# EAGLE schematic Dx32_V1.0 (EAGLE 9.6.2)

## Sheet 1 of 2
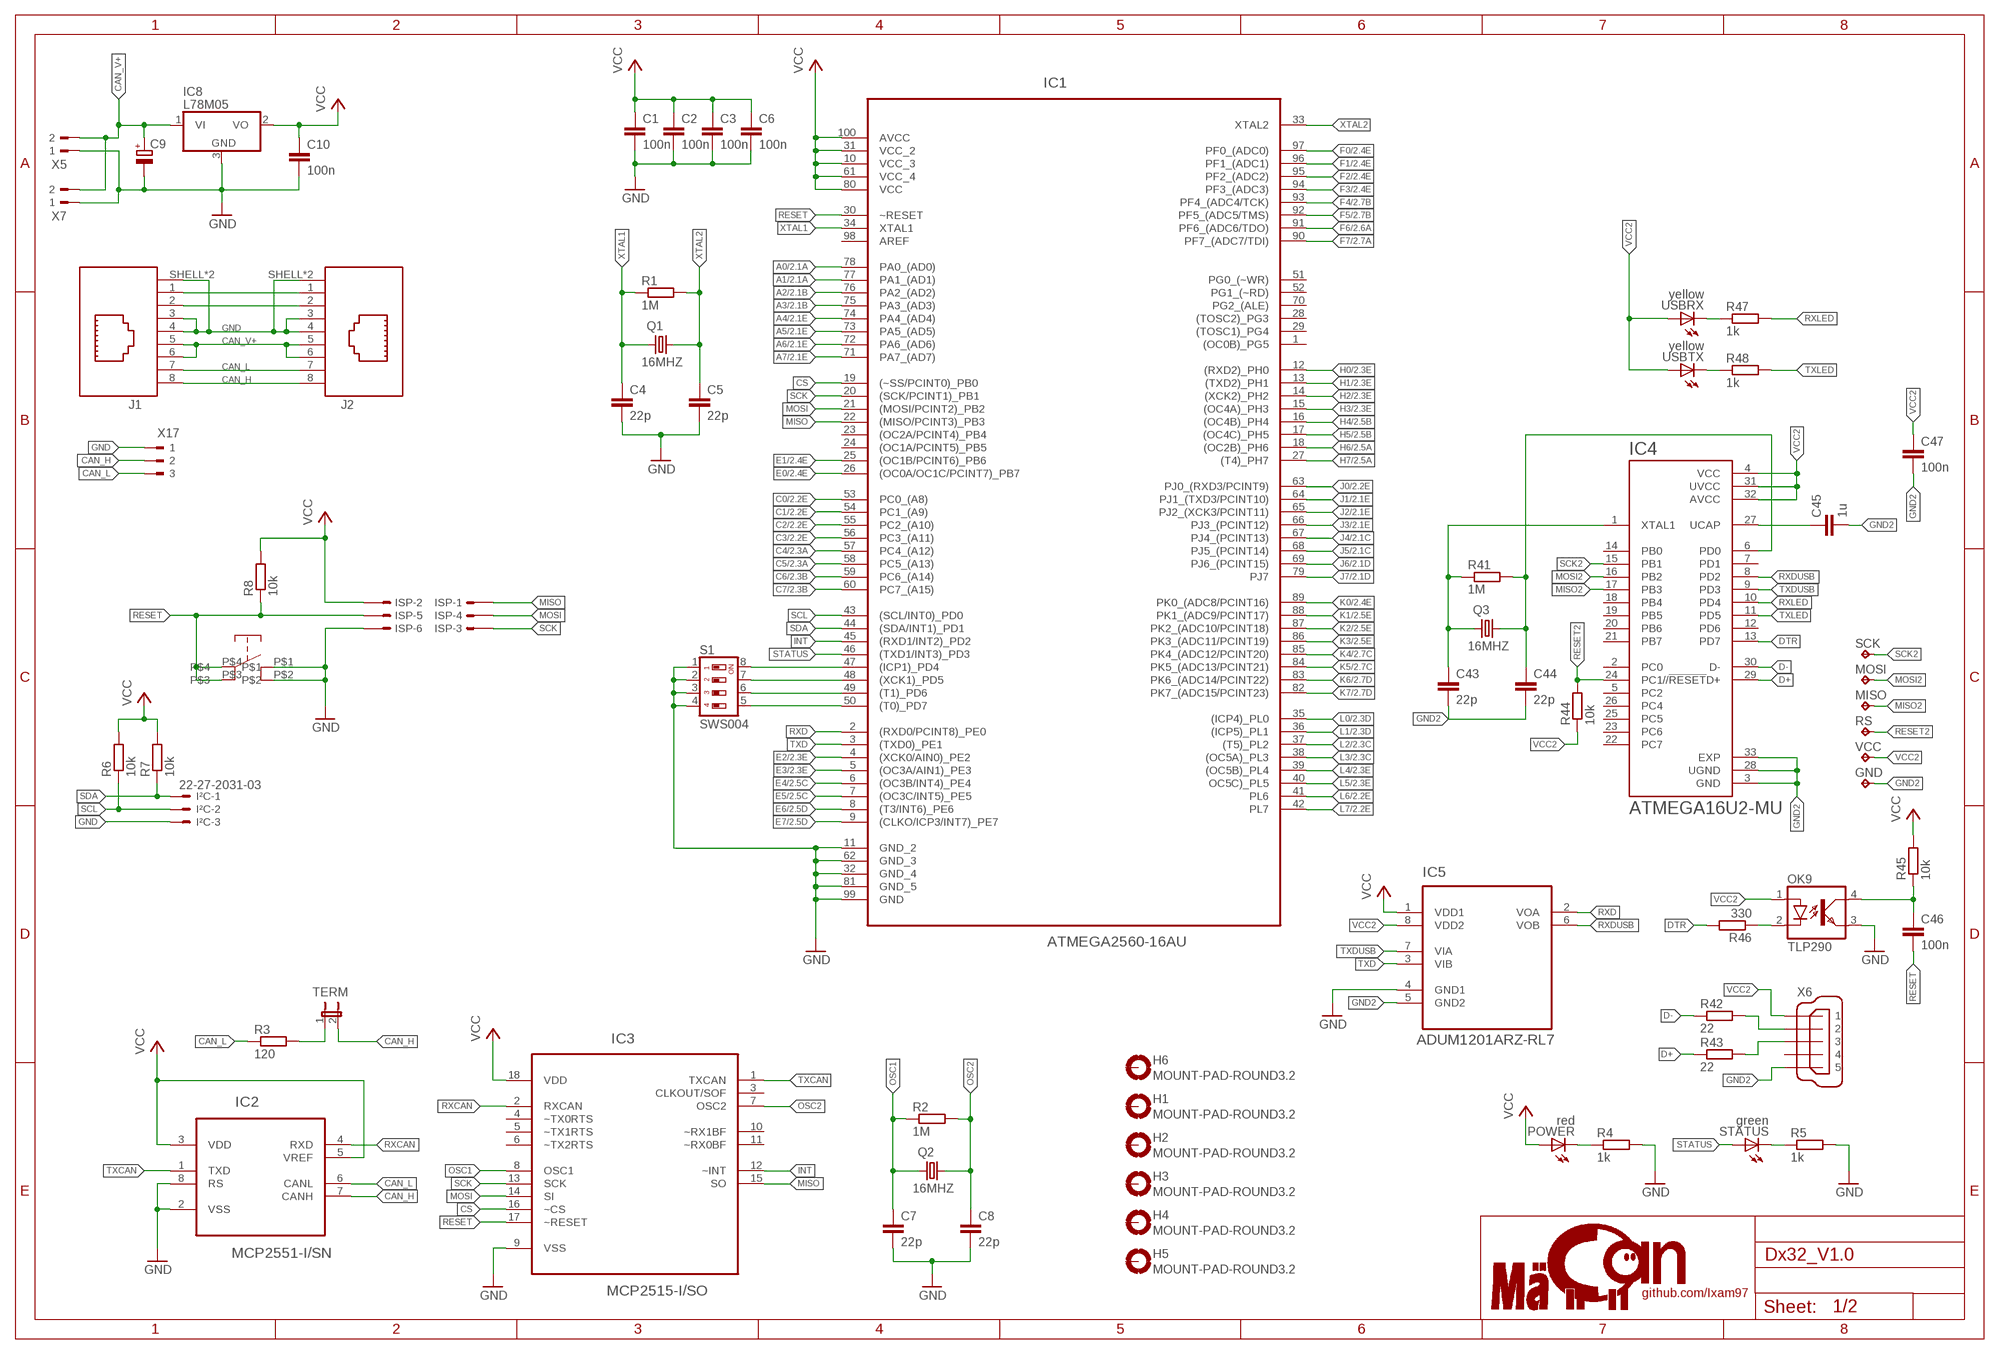
[diagram p0: schematic, sheet 1]

### Parts
C1  100n  C-EUC0402  [C0402]
C2  100n  C-EUC0402  [C0402]
C3  100n  C-EUC0402  [C0402]
C4  22p  C-EUC0402  [C0402]
C5  22p  C-EUC0402  [C0402]
C6  100n  C-EUC0402  [C0402]
C7  22p  C-EUC0402  [C0402]
C8  22p  C-EUC0402  [C0402]
C9  CPOL-EUCT3216  [CT3216]
C10  100n  C-EUC0402  [C0402]
C43  22p  C-EUC0402  [C0402]
C44  22p  C-EUC0402  [C0402]
C45  1u  C-EUC0402  [C0402]
C46  100n  C-EUC0402  [C0402]
C47  100n  C-EUC0402  [C0402]
GND  TPB1,27  [B1,27]
H1  MOUNT-PAD-ROUND3.2  [3,2-PAD]
H2  MOUNT-PAD-ROUND3.2  [3,2-PAD]
H3  MOUNT-PAD-ROUND3.2  [3,2-PAD]
H4  MOUNT-PAD-ROUND3.2  [3,2-PAD]
H5  MOUNT-PAD-ROUND3.2  [3,2-PAD]
H6  MOUNT-PAD-ROUND3.2  [3,2-PAD]
IC1  ATMEGA2560-16AU  [QFP50P1600X1600X120-100N]
IC2  MCP2551-I/SN  [SOIC127P600X175-8N]
IC3  MCP2515-I/SO  [SOIC127P1034X264-18N]
IC4  ATMEGA16U2-MU  [QFN50P500X500X100-33N]
IC5  ADUM1201ARZ-RL7  [SOIC127P600X175-8N]
IC8  L78M05  7805DT  [TO252]
ISP  057-006-1  [057-006-1]
I²C  22-27-2031-03  [6410-03]
J1  615008140421  [615008140421]
J2  615008140421  [615008140421]
MISO  TPB1,27  [B1,27]
MOSI  TPB1,27  [B1,27]
OK9  TLP290  TLP283  [MINI-FLAT-4]
POWER  red  LEDCHIP-LED0805  [CHIP-LED0805]
Q1  16MHZ  KX-7  [3.2X2.5_KX-7]
Q2  16MHZ  KX-7  [3.2X2.5_KX-7]
Q3  16MHZ  KX-7  [3.2X2.5_KX-7]
R1  1M  R-EU_R0402  [R0402]
R2  1M  R-EU_R0402  [R0402]
R3  120  R-EU_R0402  [R0402]
R4  1k  R-EU_R0402  [R0402]
R5  1k  R-EU_R0402  [R0402]
R6  10k  R-EU_R0402  [R0402]
R7  10k  R-EU_R0402  [R0402]
R8  10k  R-EU_R0402  [R0402]
R41  1M  R-EU_R0402  [R0402]
R42  22  R-EU_R0402  [R0402]
R43  22  R-EU_R0402  [R0402]
R44  10k  R-EU_R0402  [R0402]
R45  10k  R-EU_R0402  [R0402]
R46  330  R-EU_R0402  [R0402]
R47  1k  R-EU_R0402  [R0402]
R48  1k  R-EU_R0402  [R0402]
RS  TPB1,27  [B1,27]
S1  SWS004  [SMS-004]
SCK  TPB1,27  [B1,27]
STATUS  green  LEDCHIP-LED0805  [CHIP-LED0805]
TERM  JP1E  [JP1]
U$15  BUTTON_JLC  [BUTTON]
USBRX  yellow  LEDCHIP-LED0805  [CHIP-LED0805]
USBTX  yellow  LEDCHIP-LED0805  [CHIP-LED0805]
VCC  TPB1,27  [B1,27]
X5  180-2  [180-2]
X6  MINI-USB_SHIELD5P2-32005-601  [32005-601]
X7  180-2  [180-2]
X17  180-3  [180-3]

### Nets
A0: IC1.78(PA0_(AD0)) ; also sheet 2
A1: IC1.77(PA1_(AD1)) ; also sheet 2
A2: IC1.76(PA2_(AD2)) ; also sheet 2
A3: IC1.75(PA3_(AD3)) ; also sheet 2
A4: IC1.74(PA4_(AD4)) ; also sheet 2
A5: IC1.73(PA5_(AD5)) ; also sheet 2
A6: IC1.72(PA6_(AD6)) ; also sheet 2
A7: IC1.71(PA7_(AD7)) ; also sheet 2
C0: IC1.53(PC0_(A8)) ; also sheet 2
C1: IC1.54(PC1_(A9)) ; also sheet 2
C2: IC1.55(PC2_(A10)) ; also sheet 2
C3: IC1.56(PC3_(A11)) ; also sheet 2
C4: IC1.57(PC4_(A12)) ; also sheet 2
C5: IC1.58(PC5_(A13)) ; also sheet 2
C6: IC1.59(PC6_(A14)) ; also sheet 2
C7: IC1.60(PC7_(A15)) ; also sheet 2
CAN_H: IC2.7(CANH) J1.8 J2.8 TERM.2 X17.2
CAN_L: IC2.6(CANL) J1.7 J2.7 R3.1 X17.3
CAN_V+: C9.+ IC8.1(VI) J1.5 J1.6 J2.5 J2.6 X5.2 X7.2
CS: IC1.19((~SS/PCINT0)_PB0) IC3.16(~CS)
D+: IC4.29(D+) R43.1
D-: IC4.30(D-) R42.1
DTR: IC4.13(PD7) R46.2
E0: IC1.26((OC0A/OC1C/PCINT7)_PB7) ; also sheet 2
E1: IC1.25((OC1B/PCINT6)_PB6) ; also sheet 2
E2: IC1.4((XCK0/AIN0)_PE2) ; also sheet 2
E3: IC1.5((OC3A/AIN1)_PE3) ; also sheet 2
E4: IC1.6((OC3B/INT4)_PE4) ; also sheet 2
E5: IC1.7((OC3C/INT5)_PE5) ; also sheet 2
E6: IC1.8((T3/INT6)_PE6) ; also sheet 2
E7: IC1.9((CLKO/ICP3/INT7)_PE7) ; also sheet 2
F0: IC1.97(PF0_(ADC0)) ; also sheet 2
F1: IC1.96(PF1_(ADC1)) ; also sheet 2
F2: IC1.95(PF2_(ADC2)) ; also sheet 2
F3: IC1.94(PF3_(ADC3)) ; also sheet 2
F4: IC1.93(PF4_(ADC4/TCK)) ; also sheet 2
F5: IC1.92(PF5_(ADC5/TMS)) ; also sheet 2
F6: IC1.91(PF6_(ADC6/TDO)) ; also sheet 2
F7: IC1.90(PF7_(ADC7/TDI)) ; also sheet 2
GND: C1.2 C2.2 C3.2 C4.2 C5.2 C6.2 C7.2 C8.2 C9.- C10.2 IC1.11(GND_2) IC1.32(GND_4) IC1.62(GND_3) IC1.81(GND_5) IC1.99(GND) IC2.2(VSS) IC2.8(RS) IC3.9(VSS) IC5.4(GND1) IC8.3(GND) ISP.6 I²C.3 J1.3 J1.4 J1.SHELL1(SHIELD) J1.SHELL(SHIELD) J2.3 J2.4 J2.SHELL1(SHIELD) J2.SHELL(SHIELD) OK9.3(EMIT) R4.2 R5.2 S1.1 S1.2 S1.3 S1.4 U$15.P$1 U$15.P$2 X5.1 X7.1 X17.1 ; also sheet 2
GND2: C43.2 C44.2 C45.2 C47.2 GND.TP IC4.3(GND) IC4.28(UGND) IC4.33(EXP) IC5.5(GND2) X6.5
H0: IC1.12((RXD2)_PH0) ; also sheet 2
H1: IC1.13((TXD2)_PH1) ; also sheet 2
H2: IC1.14((XCK2)_PH2) ; also sheet 2
H3: IC1.15((OC4A)_PH3) ; also sheet 2
H4: IC1.16((OC4B)_PH4) ; also sheet 2
H5: IC1.17((OC4C)_PH5) ; also sheet 2
H6: IC1.18((OC2B)_PH6) ; also sheet 2
H7: IC1.27((T4)_PH7) ; also sheet 2
INT: IC1.45((RXD1/INT2)_PD2) IC3.12(~INT)
J0: IC1.63(PJ0_(RXD3/PCINT9)) ; also sheet 2
J1: IC1.64(PJ1_(TXD3/PCINT10)) ; also sheet 2
J2: IC1.65(PJ2_(XCK3/PCINT11)) ; also sheet 2
J3: IC1.66(PJ3_(PCINT12)) ; also sheet 2
J4: IC1.67(PJ4_(PCINT13)) ; also sheet 2
J5: IC1.68(PJ5_(PCINT14)) ; also sheet 2
J6: IC1.69(PJ6_(PCINT15)) ; also sheet 2
J7: IC1.79(PJ7) ; also sheet 2
K0: IC1.89(PK0_(ADC8/PCINT16)) ; also sheet 2
K1: IC1.88(PK1_(ADC9/PCINT17)) ; also sheet 2
K2: IC1.87(PK2_(ADC10/PCINT18)) ; also sheet 2
K3: IC1.86(PK3_(ADC11/PCINT19)) ; also sheet 2
K4: IC1.85(PK4_(ADC12/PCINT20)) ; also sheet 2
K5: IC1.84(PK5_(ADC13/PCINT21)) ; also sheet 2
K6: IC1.83(PK6_(ADC14/PCINT22)) ; also sheet 2
K7: IC1.82(PK7_(ADC15/PCINT23)) ; also sheet 2
L0: IC1.35((ICP4)_PL0) ; also sheet 2
L1: IC1.36((ICP5)_PL1) ; also sheet 2
L2: IC1.37((T5)_PL2) ; also sheet 2
L3: IC1.38((OC5A)_PL3) ; also sheet 2
L4: IC1.39((OC5B)_PL4) ; also sheet 2
L5: IC1.40(OC5C)_PL5) ; also sheet 2
L6: IC1.41(PL6) ; also sheet 2
L7: IC1.42(PL7) ; also sheet 2
MISO: IC1.22((MISO/PCINT3)_PB3) IC3.15(SO) ISP.1
MISO2: IC4.17(PB3) MISO.TP
MOSI: IC1.21((MOSI/PCINT2)_PB2) IC3.14(SI) ISP.4
MOSI2: IC4.16(PB2) MOSI.TP
N$10: C46.1 OK9.4(COL) R45.1
N$17: IC1.47((ICP1)_PD4) S1.8
N$18: IC1.48((XCK1)_PD5) S1.7
N$19: IC1.49((T1)_PD6) S1.6
N$20: IC1.50((T0)_PD7) S1.5
N$21: J1.1 J2.1
N$27: OK9.2(C) R46.1
N$39: J1.2 J2.2
N$49: R48.1 USBTX.C
N$62: R47.1 USBRX.C
N$128: C45.1 IC4.27(UCAP)
N$129: R42.2 X6.2
N$130: R43.2 X6.3
N$133: POWER.C R4.1
N$134: R3.2 TERM.1
N$137: R5.1 STATUS.C
OSC1: C7.1 IC3.8(OSC1) Q2.1 R2.1
OSC2: C8.1 IC3.7(OSC2) Q2.3 R2.2
OSC3: C43.1 IC4.1(XTAL1) Q3.1 R41.1
OSC4: C44.1 IC4.6(PD0) Q3.3 R41.2
RESET: C46.2 IC1.30(~RESET) IC3.17(~RESET) ISP.5 R8.1 U$15.P$3 U$15.P$4
RESET2: IC4.24(PC1//!RESET) R44.2 RS.TP
RXCAN: IC2.4(RXD) IC3.2(RXCAN)
RXD: IC1.2((RXD0/PCINT8)_PE0) IC5.2(VOA)
RXDUSB: IC4.8(PD2) IC5.6(VOB)
RXLED: IC4.10(PD4) R47.2
SCK: IC1.20((SCK/PCINT1)_PB1) IC3.13(SCK) ISP.3
SCK2: IC4.15(PB1) SCK.TP
SCL: IC1.43((SCL/INT0)_PD0) I²C.2 R6.1
SDA: IC1.44((SDA/INT1)_PD1) I²C.1 R7.1
STATUS: IC1.46((TXD1/INT3)_PD3) STATUS.A
TXCAN: IC2.1(TXD) IC3.1(TXCAN)
TXD: IC1.3((TXD0)_PE1) IC5.3(VIB)
TXDUSB: IC4.9(PD3) IC5.7(VIA)
TXLED: IC4.11(PD5) R48.2
VCC: C1.1 C2.1 C3.1 C6.1 C10.1 IC1.10(VCC_3) IC1.31(VCC_2) IC1.61(VCC_4) IC1.80(VCC) IC1.100(AVCC) IC2.3(VDD) IC2.5(VREF) IC3.18(VDD) IC5.1(VDD1) IC8.2(VO) ISP.2 POWER.A R6.2 R7.2 R8.2 R45.2 ; also sheet 2
VCC2: C47.1 IC4.4(VCC) IC4.31(UVCC) IC4.32(AVCC) IC5.8(VDD2) OK9.1(A) R44.1 USBRX.A USBTX.A VCC.TP X6.1
XTAL1: C4.1 IC1.34(XTAL1) Q1.1 R1.1
XTAL2: C5.1 IC1.33(XTAL2) Q1.3 R1.2
Unconnected: H1.B3,2(MOUNT) H2.B3,2(MOUNT) H3.B3,2(MOUNT) H4.B3,2(MOUNT) H5.B3,2(MOUNT) H6.B3,2(MOUNT) IC1.1((OC0B)_PG5) IC1.23((OC2A/PCINT4)_PB4) IC1.24((OC1A/PCINT5)_PB5) IC1.28((TOSC2)_PG3) IC1.29((TOSC1)_PG4) IC1.51(PG0_(~WR)) IC1.52(PG1_(~RD)) IC1.70(PG2_(ALE)) IC1.98(AREF) IC3.3(CLKOUT/SOF) IC3.4(~TX0RTS) IC3.5(~TX1RTS) IC3.6(~TX2RTS) IC3.10(~RX1BF) IC3.11(~RX0BF) IC4.2(PC0) IC4.5(PC2) IC4.7(PD1) IC4.12(PD6) IC4.14(PB0) IC4.18(PB4) IC4.19(PB5) IC4.20(PB6) IC4.21(PB7) IC4.22(PC7) IC4.23(PC6) IC4.25(PC5) IC4.26(PC4) X6.4 X6.M1(S1) X6.M2(S2)

## Sheet 2 of 2
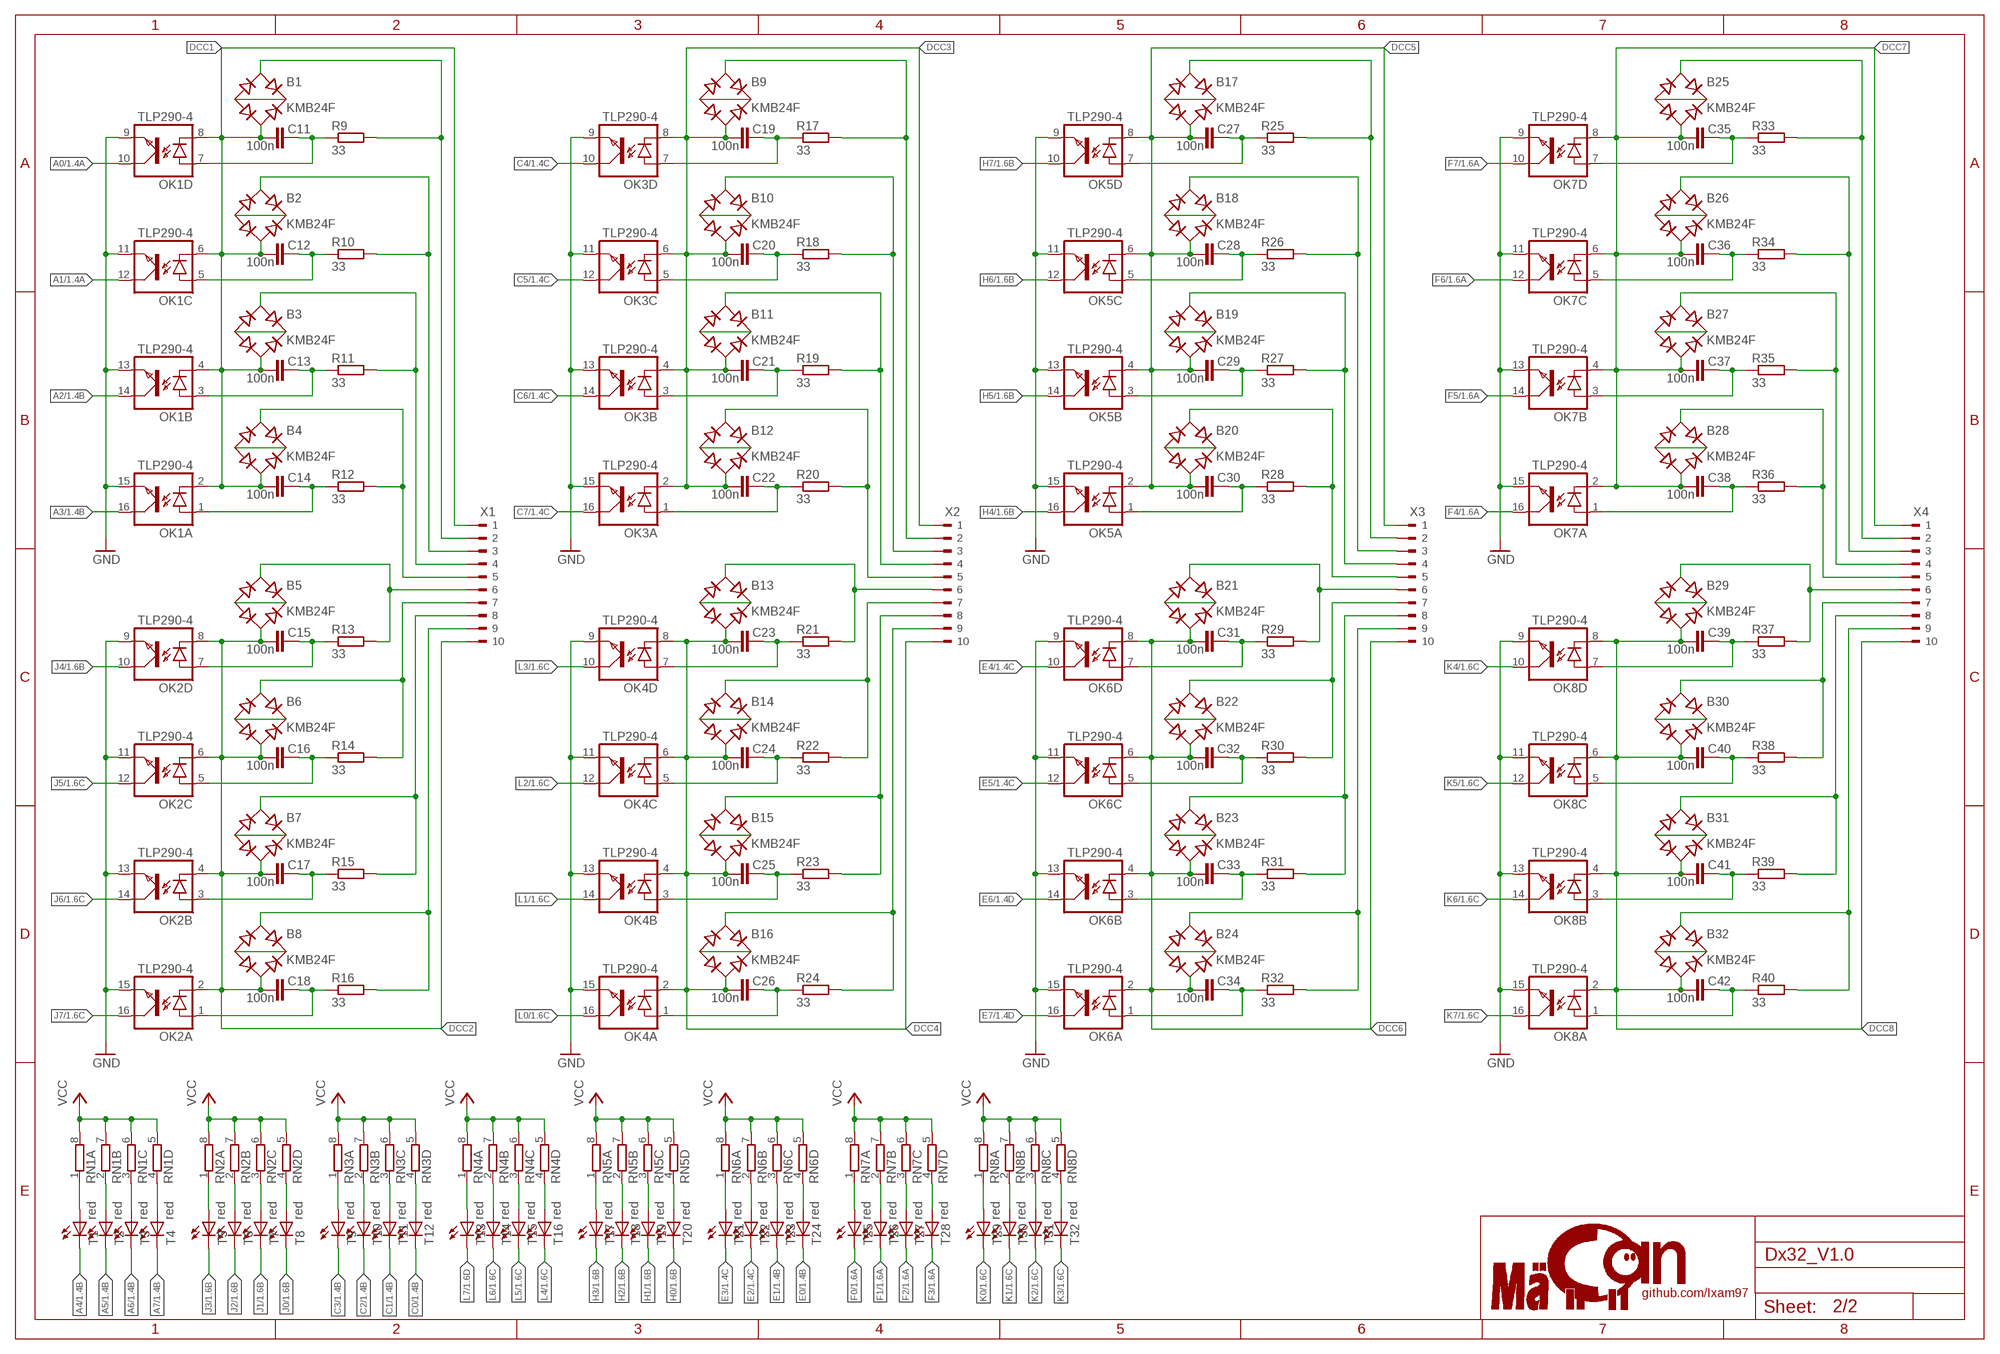
[diagram p1: schematic, sheet 2]

### Parts
B1  KMB24F  B2S  [MBS]
B2  KMB24F  B2S  [MBS]
B3  KMB24F  B2S  [MBS]
B4  KMB24F  B2S  [MBS]
B5  KMB24F  B2S  [MBS]
B6  KMB24F  B2S  [MBS]
B7  KMB24F  B2S  [MBS]
B8  KMB24F  B2S  [MBS]
B9  KMB24F  B2S  [MBS]
B10  KMB24F  B2S  [MBS]
B11  KMB24F  B2S  [MBS]
B12  KMB24F  B2S  [MBS]
B13  KMB24F  B2S  [MBS]
B14  KMB24F  B2S  [MBS]
B15  KMB24F  B2S  [MBS]
B16  KMB24F  B2S  [MBS]
B17  KMB24F  B2S  [MBS]
B18  KMB24F  B2S  [MBS]
B19  KMB24F  B2S  [MBS]
B20  KMB24F  B2S  [MBS]
B21  KMB24F  B2S  [MBS]
B22  KMB24F  B2S  [MBS]
B23  KMB24F  B2S  [MBS]
B24  KMB24F  B2S  [MBS]
B25  KMB24F  B2S  [MBS]
B26  KMB24F  B2S  [MBS]
B27  KMB24F  B2S  [MBS]
B28  KMB24F  B2S  [MBS]
B29  KMB24F  B2S  [MBS]
B30  KMB24F  B2S  [MBS]
B31  KMB24F  B2S  [MBS]
B32  KMB24F  B2S  [MBS]
C11  100n  C-EUC0402  [C0402]
C12  100n  C-EUC0402  [C0402]
C13  100n  C-EUC0402  [C0402]
C14  100n  C-EUC0402  [C0402]
C15  100n  C-EUC0402  [C0402]
C16  100n  C-EUC0402  [C0402]
C17  100n  C-EUC0402  [C0402]
C18  100n  C-EUC0402  [C0402]
C19  100n  C-EUC0402  [C0402]
C20  100n  C-EUC0402  [C0402]
C21  100n  C-EUC0402  [C0402]
C22  100n  C-EUC0402  [C0402]
C23  100n  C-EUC0402  [C0402]
C24  100n  C-EUC0402  [C0402]
C25  100n  C-EUC0402  [C0402]
C26  100n  C-EUC0402  [C0402]
C27  100n  C-EUC0402  [C0402]
C28  100n  C-EUC0402  [C0402]
C29  100n  C-EUC0402  [C0402]
C30  100n  C-EUC0402  [C0402]
C31  100n  C-EUC0402  [C0402]
C32  100n  C-EUC0402  [C0402]
C33  100n  C-EUC0402  [C0402]
C34  100n  C-EUC0402  [C0402]
C35  100n  C-EUC0402  [C0402]
C36  100n  C-EUC0402  [C0402]
C37  100n  C-EUC0402  [C0402]
C38  100n  C-EUC0402  [C0402]
C39  100n  C-EUC0402  [C0402]
C40  100n  C-EUC0402  [C0402]
C41  100n  C-EUC0402  [C0402]
C42  100n  C-EUC0402  [C0402]
OK1  TLP290-4  TLP283-4  [MINI-FLAT-16]
OK2  TLP290-4  TLP283-4  [MINI-FLAT-16]
OK3  TLP290-4  TLP283-4  [MINI-FLAT-16]
OK4  TLP290-4  TLP283-4  [MINI-FLAT-16]
OK5  TLP290-4  TLP283-4  [MINI-FLAT-16]
OK6  TLP290-4  TLP283-4  [MINI-FLAT-16]
OK7  TLP290-4  TLP283-4  [MINI-FLAT-16]
OK8  TLP290-4  TLP283-4  [MINI-FLAT-16]
R9  33  R-EU_R0402  [R0402]
R10  33  R-EU_R0402  [R0402]
R11  33  R-EU_R0402  [R0402]
R12  33  R-EU_R0402  [R0402]
R13  33  R-EU_R0402  [R0402]
R14  33  R-EU_R0402  [R0402]
R15  33  R-EU_R0402  [R0402]
R16  33  R-EU_R0402  [R0402]
R17  33  R-EU_R0402  [R0402]
R18  33  R-EU_R0402  [R0402]
R19  33  R-EU_R0402  [R0402]
R20  33  R-EU_R0402  [R0402]
R21  33  R-EU_R0402  [R0402]
R22  33  R-EU_R0402  [R0402]
R23  33  R-EU_R0402  [R0402]
R24  33  R-EU_R0402  [R0402]
R25  33  R-EU_R0402  [R0402]
R26  33  R-EU_R0402  [R0402]
R27  33  R-EU_R0402  [R0402]
R28  33  R-EU_R0402  [R0402]
R29  33  R-EU_R0402  [R0402]
R30  33  R-EU_R0402  [R0402]
R31  33  R-EU_R0402  [R0402]
R32  33  R-EU_R0402  [R0402]
R33  33  R-EU_R0402  [R0402]
R34  33  R-EU_R0402  [R0402]
R35  33  R-EU_R0402  [R0402]
R36  33  R-EU_R0402  [R0402]
R37  33  R-EU_R0402  [R0402]
R38  33  R-EU_R0402  [R0402]
R39  33  R-EU_R0402  [R0402]
R40  33  R-EU_R0402  [R0402]
RN1  4R-N0603-ARV  [0603-ARV]
RN2  4R-N0603-ARV  [0603-ARV]
RN3  4R-N0603-ARV  [0603-ARV]
RN4  4R-N0603-ARV  [0603-ARV]
RN5  4R-N0603-ARV  [0603-ARV]
RN6  4R-N0603-ARV  [0603-ARV]
RN7  4R-N0603-ARV  [0603-ARV]
RN8  4R-N0603-ARV  [0603-ARV]
T1  red  LEDCHIP-LED0805  [CHIP-LED0805]
T2  red  LEDCHIP-LED0805  [CHIP-LED0805]
T3  red  LEDCHIP-LED0805  [CHIP-LED0805]
T4  red  LEDCHIP-LED0805  [CHIP-LED0805]
T5  red  LEDCHIP-LED0805  [CHIP-LED0805]
T6  red  LEDCHIP-LED0805  [CHIP-LED0805]
T7  red  LEDCHIP-LED0805  [CHIP-LED0805]
T8  red  LEDCHIP-LED0805  [CHIP-LED0805]
T9  red  LEDCHIP-LED0805  [CHIP-LED0805]
T10  red  LEDCHIP-LED0805  [CHIP-LED0805]
T11  red  LEDCHIP-LED0805  [CHIP-LED0805]
T12  red  LEDCHIP-LED0805  [CHIP-LED0805]
T13  red  LEDCHIP-LED0805  [CHIP-LED0805]
T14  red  LEDCHIP-LED0805  [CHIP-LED0805]
T15  red  LEDCHIP-LED0805  [CHIP-LED0805]
T16  red  LEDCHIP-LED0805  [CHIP-LED0805]
T17  red  LEDCHIP-LED0805  [CHIP-LED0805]
T18  red  LEDCHIP-LED0805  [CHIP-LED0805]
T19  red  LEDCHIP-LED0805  [CHIP-LED0805]
T20  red  LEDCHIP-LED0805  [CHIP-LED0805]
T21  red  LEDCHIP-LED0805  [CHIP-LED0805]
T22  red  LEDCHIP-LED0805  [CHIP-LED0805]
T23  red  LEDCHIP-LED0805  [CHIP-LED0805]
T24  red  LEDCHIP-LED0805  [CHIP-LED0805]
T25  red  LEDCHIP-LED0805  [CHIP-LED0805]
T26  red  LEDCHIP-LED0805  [CHIP-LED0805]
T27  red  LEDCHIP-LED0805  [CHIP-LED0805]
T28  red  LEDCHIP-LED0805  [CHIP-LED0805]
T29  red  LEDCHIP-LED0805  [CHIP-LED0805]
T30  red  LEDCHIP-LED0805  [CHIP-LED0805]
T31  red  LEDCHIP-LED0805  [CHIP-LED0805]
T32  red  LEDCHIP-LED0805  [CHIP-LED0805]
X1  180-10  [180-10]
X2  180-10  [180-10]
X3  180-10  [180-10]
X4  180-10  [180-10]

### Nets
A0: OK1.10(D:COL) ; also sheet 1
A1: OK1.12(C:COL) ; also sheet 1
A2: OK1.14(B:COL) ; also sheet 1
A3: OK1.16(A:COL) ; also sheet 1
A4: T1.C ; also sheet 1
A5: T2.C ; also sheet 1
A6: T3.C ; also sheet 1
A7: T4.C ; also sheet 1
C0: T12.C ; also sheet 1
C1: T11.C ; also sheet 1
C2: T10.C ; also sheet 1
C3: T9.C ; also sheet 1
C4: OK3.10(D:COL) ; also sheet 1
C5: OK3.12(C:COL) ; also sheet 1
C6: OK3.14(B:COL) ; also sheet 1
C7: OK3.16(A:COL) ; also sheet 1
DCC1: B1.AC2 B2.AC2 B3.AC2 B4.AC2 C11.2 C12.2 C13.2 C14.2 OK1.2(A:C) OK1.4(B:C) OK1.6(C:C) OK1.8(D:C) X1.1
DCC2: B5.AC2 B6.AC2 B7.AC2 B8.AC2 C15.2 C16.2 C17.2 C18.2 OK2.2(A:C) OK2.4(B:C) OK2.6(C:C) OK2.8(D:C) X1.10
DCC3: B9.AC2 B10.AC2 B11.AC2 B12.AC2 C19.2 C20.2 C21.2 C22.2 OK3.2(A:C) OK3.4(B:C) OK3.6(C:C) OK3.8(D:C) X2.1
DCC4: B13.AC2 B14.AC2 B15.AC2 B16.AC2 C23.2 C24.2 C25.2 C26.2 OK4.2(A:C) OK4.4(B:C) OK4.6(C:C) OK4.8(D:C) X2.10
DCC5: B17.AC2 B18.AC2 B19.AC2 B20.AC2 C27.2 C28.2 C29.2 C30.2 OK5.2(A:C) OK5.4(B:C) OK5.6(C:C) OK5.8(D:C) X3.1
DCC6: B21.AC2 B22.AC2 B23.AC2 B24.AC2 C31.2 C32.2 C33.2 C34.2 OK6.2(A:C) OK6.4(B:C) OK6.6(C:C) OK6.8(D:C) X3.10
DCC7: B25.AC2 B26.AC2 B27.AC2 B28.AC2 C35.2 C36.2 C37.2 C38.2 OK7.2(A:C) OK7.4(B:C) OK7.6(C:C) OK7.8(D:C) X4.1
DCC8: B29.AC2 B30.AC2 B31.AC2 B32.AC2 C39.2 C40.2 C41.2 C42.2 OK8.2(A:C) OK8.4(B:C) OK8.6(C:C) OK8.8(D:C) X4.10
E0: T24.C ; also sheet 1
E1: T23.C ; also sheet 1
E2: T22.C ; also sheet 1
E3: T21.C ; also sheet 1
E4: OK6.10(D:COL) ; also sheet 1
E5: OK6.12(C:COL) ; also sheet 1
E6: OK6.14(B:COL) ; also sheet 1
E7: OK6.16(A:COL) ; also sheet 1
F0: T25.C ; also sheet 1
F1: T26.C ; also sheet 1
F2: T27.C ; also sheet 1
F3: T28.C ; also sheet 1
F4: OK7.16(A:COL) ; also sheet 1
F5: OK7.14(B:COL) ; also sheet 1
F6: OK7.12(C:COL) ; also sheet 1
F7: OK7.10(D:COL) ; also sheet 1
GND: OK1.9(D:EMIT) OK1.11(C:EMIT) OK1.13(B:EMIT) OK1.15(A:EMIT) OK2.9(D:EMIT) OK2.11(C:EMIT) OK2.13(B:EMIT) OK2.15(A:EMIT) OK3.9(D:EMIT) OK3.11(C:EMIT) OK3.13(B:EMIT) OK3.15(A:EMIT) OK4.9(D:EMIT) OK4.11(C:EMIT) OK4.13(B:EMIT) OK4.15(A:EMIT) OK5.9(D:EMIT) OK5.11(C:EMIT) OK5.13(B:EMIT) OK5.15(A:EMIT) OK6.9(D:EMIT) OK6.11(C:EMIT) OK6.13(B:EMIT) OK6.15(A:EMIT) OK7.9(D:EMIT) OK7.11(C:EMIT) OK7.13(B:EMIT) OK7.15(A:EMIT) OK8.9(D:EMIT) OK8.11(C:EMIT) OK8.13(B:EMIT) OK8.15(A:EMIT) ; also sheet 1
H0: T20.C ; also sheet 1
H1: T19.C ; also sheet 1
H2: T18.C ; also sheet 1
H3: T17.C ; also sheet 1
H4: OK5.16(A:COL) ; also sheet 1
H5: OK5.14(B:COL) ; also sheet 1
H6: OK5.12(C:COL) ; also sheet 1
H7: OK5.10(D:COL) ; also sheet 1
J0: T8.C ; also sheet 1
J1: T7.C ; also sheet 1
J2: T6.C ; also sheet 1
J3: T5.C ; also sheet 1
J4: OK2.10(D:COL) ; also sheet 1
J5: OK2.12(C:COL) ; also sheet 1
J6: OK2.14(B:COL) ; also sheet 1
J7: OK2.16(A:COL) ; also sheet 1
K0: T29.C ; also sheet 1
K1: T30.C ; also sheet 1
K2: T31.C ; also sheet 1
K3: T32.C ; also sheet 1
K4: OK8.10(D:COL) ; also sheet 1
K5: OK8.12(C:COL) ; also sheet 1
K6: OK8.14(B:COL) ; also sheet 1
K7: OK8.16(A:COL) ; also sheet 1
L0: OK4.16(A:COL) ; also sheet 1
L1: OK4.14(B:COL) ; also sheet 1
L2: OK4.12(C:COL) ; also sheet 1
L3: OK4.10(D:COL) ; also sheet 1
L4: T16.C ; also sheet 1
L5: T15.C ; also sheet 1
L6: T14.C ; also sheet 1
L7: T13.C ; also sheet 1
N$1: B1.+ B1.-
N$2: B1.AC1 R9.2 X1.2
N$3: B5.+ B5.-
N$4: C11.1 OK1.7(D:A) R9.1
N$5: B2.+ B2.-
N$6: B2.AC1 R10.2 X1.3
N$7: B3.+ B3.-
N$8: C12.1 OK1.5(C:A) R10.1
N$9: B24.AC1 R32.2 X3.9
N$11: C13.1 OK1.3(B:A) R11.1
N$12: B4.+ B4.-
N$13: B4.AC1 R12.2 X1.5
N$14: C14.1 OK1.1(A:A) R12.1
N$15: B5.AC1 R13.2 X1.6
N$16: C15.1 OK2.7(D:A) R13.1
N$22: B6.+ B6.-
N$23: B6.AC1 R14.2 X1.7
N$24: C16.1 OK2.5(C:A) R14.1
N$25: B7.+ B7.-
N$26: B7.AC1 R15.2 X1.8
N$28: C17.1 OK2.3(B:A) R15.1
N$29: B8.+ B8.-
N$30: B8.AC1 R16.2 X1.9
N$31: C18.1 OK2.1(A:A) R16.1
N$32: RN1.1 T1.A
N$33: RN1.2 T2.A
N$34: RN1.3 T3.A
N$35: RN1.4 T4.A
N$36: RN2.1 T5.A
N$37: RN2.2 T6.A
N$38: RN2.3 T7.A
N$40: RN2.4 T8.A
N$41: B9.+ B9.-
N$42: B9.AC1 R17.2 X2.2
N$43: C19.1 OK3.7(D:A) R17.1
N$44: B10.+ B10.-
N$45: B10.AC1 R18.2 X2.3
N$46: C20.1 OK3.5(C:A) R18.1
N$47: B11.+ B11.-
N$48: B11.AC1 R19.2 X2.4
N$50: C21.1 OK3.3(B:A) R19.1
N$51: B12.+ B12.-
N$52: B12.AC1 R20.2 X2.5
N$53: C22.1 OK3.1(A:A) R20.1
N$54: B13.+ B13.-
N$55: B13.AC1 R21.2 X2.6
N$56: C23.1 OK4.7(D:A) R21.1
N$57: B14.+ B14.-
N$58: B14.AC1 R22.2 X2.7
N$59: C24.1 OK4.5(C:A) R22.1
N$60: B15.+ B15.-
N$61: B15.AC1 R23.2 X2.8
N$63: C25.1 OK4.3(B:A) R23.1
N$64: B16.+ B16.-
N$65: B16.AC1 R24.2 X2.9
N$66: C26.1 OK4.1(A:A) R24.1
N$67: B17.+ B17.-
N$68: B17.AC1 R25.2 X3.2
N$69: C27.1 OK5.7(D:A) R25.1
N$70: B18.+ B18.-
N$71: B18.AC1 R26.2 X3.3
N$72: C28.1 OK5.5(C:A) R26.1
N$73: B19.+ B19.-
N$74: B19.AC1 R27.2 X3.4
N$76: C29.1 OK5.3(B:A) R27.1
N$77: B20.+ B20.-
N$78: B20.AC1 R28.2 X3.5
N$79: C30.1 OK5.1(A:A) R28.1
N$80: B21.+ B21.-
N$82: C31.1 OK6.7(D:A) R29.1
N$83: B22.+ B22.-
N$84: B32.AC1 R40.2 X4.9
N$85: C32.1 OK6.5(C:A) R30.1
N$86: B23.+ B23.-
N$87: B23.AC1 R31.2 X3.8
N$89: C33.1 OK6.3(B:A) R31.1
N$90: B24.+ B24.-
N$91: B31.AC1 R39.2 X4.8
N$92: C34.1 OK6.1(A:A) R32.1
N$93: B25.+ B25.-
N$94: B25.AC1 R33.2 X4.2
N$95: C35.1 OK7.7(D:A) R33.1
N$96: B26.+ B26.-
N$97: B26.AC1 R34.2 X4.3
N$98: C36.1 OK7.5(C:A) R34.1
N$99: B27.+ B27.-
N$100: B27.AC1 R35.2 X4.4
N$101: B3.AC1 R11.2 X1.4
N$102: C37.1 OK7.3(B:A) R35.1
N$103: B28.+ B28.-
N$104: B28.AC1 R36.2 X4.5
N$105: C38.1 OK7.1(A:A) R36.1
N$106: B29.+ B29.-
N$108: C39.1 OK8.7(D:A) R37.1
N$109: B30.+ B30.-
N$111: C40.1 OK8.5(C:A) R38.1
N$112: B31.+ B31.-
N$114: B30.AC1 R38.2 X4.7
N$115: C41.1 OK8.3(B:A) R39.1
N$116: B32.+ B32.-
N$118: C42.1 OK8.1(A:A) R40.1
N$119: RN3.1 T9.A
N$120: RN3.2 T10.A
N$121: RN3.3 T11.A
N$122: RN3.4 T12.A
N$123: RN4.1 T13.A
N$124: RN4.2 T14.A
N$125: RN4.3 T15.A
N$126: RN4.4 T16.A
N$127: B22.AC1 R30.2 X3.7
N$131: RN5.1 T17.A
N$136: RN5.2 T18.A
N$138: RN5.3 T19.A
N$139: RN5.4 T20.A
N$140: RN6.1 T21.A
N$141: RN6.2 T22.A
N$142: RN6.3 T23.A
N$143: RN6.4 T24.A
N$144: RN7.1 T25.A
N$145: RN7.2 T26.A
N$146: RN7.3 T27.A
N$147: RN7.4 T28.A
N$148: RN8.1 T29.A
N$149: RN8.2 T30.A
N$150: RN8.3 T31.A
N$151: RN8.4 T32.A
N$152: B21.AC1 R29.2 X3.6
N$153: B29.AC1 R37.2 X4.6
VCC: RN1.5 RN1.6 RN1.7 RN1.8 RN2.5 RN2.6 RN2.7 RN2.8 RN3.5 RN3.6 RN3.7 RN3.8 RN4.5 RN4.6 RN4.7 RN4.8 RN5.5 RN5.6 RN5.7 RN5.8 RN6.5 RN6.6 RN6.7 RN6.8 RN7.5 RN7.6 RN7.7 RN7.8 RN8.5 RN8.6 RN8.7 RN8.8 ; also sheet 1

## Library data of the parts
B1 = rectifier:B*S: Surface Mount Glass Passivated Bridge Rectifiers Source: Comchip Bridge Rectifiers B05S-G_B10S-G.pdf; JLCPCB-PART: C113927
B2-B32 = rectifier:B*S: Surface Mount Glass Passivated Bridge Rectifiers Source: Comchip Bridge Rectifiers B05S-G_B10S-G.pdf
C1-C8 C10-C47 = rcl:C-EU: CAPACITOR, European symbol; SPICEPREFIX: C
C9 = rcl:CPOL-EU: POLARIZED CAPACITOR, European symbol; SPICEPREFIX: C
GND MISO MOSI RS SCK VCC = testpad:TP: Test pad
H1-H6 = holes:MOUNT-PAD-ROUND: MOUNTING PAD, round
IC1 = ATMEGA2560-16AU:ATMEGA2560-16AU: Microcontroller; AVAILABILITY: Unavailable; DESCRIPTION: AVR AVR® ATmega Microcontroller IC 8-Bit 16MHz 256KB _128K x 16_ FLASH 100-TQFP _14x14_; MF: Microchip; MP: ATMEGA2560-16AU; PACKAGE: TQFP-100 Adesto Technologies; PRICE: None
IC2 = Microchip_By_element14_Batch_1:MCP2551-I/SN: High-Speed CAN Transceiver; MPN: MCP2551-I/SN; OC_FARNELL: 9758569; OC_NEWARK: 69K7604; PACKAGE: SOIC-8; SUPPLIER: Microchip
IC3 = Microchip_By_element14_Batch_1:MCP2515-I/SO: CAN Controller; MPN: MCP2515-I/SO; OC_FARNELL: 1292239; OC_NEWARK: 29H7136; PACKAGE: SOIC-18; SUPPLIER: Microchip
IC4 = ATMEGA16U2-MU:ATMEGA16U2-MU: Avr Usb 8k Flash - Avr Usb 16k Flash Qfn32 Industrial Optim Check prices <https://pricing.snapeda.com/search/part/ATMEGA16U2-MU/?ref=eda>; AVAILABILITY: Good; DESCRIPTION: AVR AVR® ATmega Microcontroller IC 8-Bit 16MHz 16KB (8K x 16) FLASH 32-VQFN (5x5); MF: Microchip; MP: ATMEGA16U2-MU; PACKAGE: VQFN-32 Microchip; PRICE: None; PURCHASE-URL: https://pricing.snapeda.com/search/part/ATMEGA16U2-MU/?ref=eda
IC5 = ADUM1201ARZ-RL7:ADUM1201ARZ-RL7: Dual-Channel Digital Isolators Check prices <https://pricing.snapeda.com/search/part/ADUM1201ARZ-RL7/?ref=eda>; AVAILABILITY: Good; DESCRIPTION: General Purpose Digital Isolator 2500Vrms 2 Channel 1Mbps 25kV/µs CMTI 8-SOIC (0.154, 3.90mm Width); MF: Analog Devices; MP: ADUM1201ARZ-RL7; PACKAGE: SOIC-8 Analog Devices; PRICE: None; PURCHASE-URL: https://pricing.snapeda.com/search/part/ADUM1201ARZ-RL7/?ref=eda
IC8 = linear:78*: Positive VOLTAGE REGULATOR Source: http://cache.national.com/ds/LM/LM78L05.pdf http://www.fairchildsemi.com/ds/LM/LM7805.pdf; JLCPCB-PART: C58069
ISP = con-panduit:057-006-: CONNECTOR 6-pin series 057 contact pc board low profile headers; OC_FARNELL: unknown; OC_NEWARK: unknown
I²C = con-molex:22-?-03: CONNECTOR wire to board 2.54 mm (.1 inch) pitch header; MF: MOLEX; OC_FARNELL: unknown; OC_NEWARK: unknown
J1 J2 = InputOutputIO (rev18b):615008140421: WR-MJ Vertical Shielded 8P8C Rear Post Modular Jack, 8 pins=>Code : Con_I-O_MJ-V_Shielded_615008140421 <http://katalog.we-online.de/media/images/eican/Con_I-O_MJ-V_Shielded_615008140421_pf2.jpg> Details see: http://katalog.we-online.de/en/em/615_008_140_421 Created 2014-07-10, Karrer Zheng 2014 (C) Würth Elektronik
OK1 = optocoupler:TLP283-4: TOSHIBA PHOTOCOUPLER GaAs IRED & PHOTO-TRANSISTOR Source: http://www.semicon.toshiba.co.jp/td/en/Opto/Photocoupler/en_20050928_TLP283_datasheet.pdf; JLCPC-PART: C39031; OC_FARNELL: unknown; OC_NEWARK: unknown
OK2-OK8 = optocoupler:TLP283-4: TOSHIBA PHOTOCOUPLER GaAs IRED & PHOTO-TRANSISTOR Source: http://www.semicon.toshiba.co.jp/td/en/Opto/Photocoupler/en_20050928_TLP283_datasheet.pdf; OC_FARNELL: unknown; OC_NEWARK: unknown
OK9 = optocoupler:TLP283: TOSHIBA PHOTOCOUPLER GaAs IRED & PHOTO-TRANSISTOR Source: http://www.semicon.toshiba.co.jp/td/en/Opto/Photocoupler/en_20050928_TLP283_datasheet.pdf; OC_FARNELL: unknown; OC_NEWARK: unknown
POWER STATUS T2-T32 USBRX USBTX = led:LED: LED OSRAM: - CHIPLED LG R971, LG N971, LY N971, LG Q971, LY Q971, LO R971, LY R971 LH N974, LH R974 LS Q976, LO Q976, LY Q976 LO Q996 - Hyper CHIPLED LW Q18S LB Q993, LB Q99A, LB R99A - SideLED LS A670, LO A670, LY A670, LG A670, LP A670 LB A673, LV A673, LT A673, LW A673 LH A674 LY A675 LS A676, LA A676, LO A676, LY A676, LW A676 LS A679, LY A679, LG A679 - Hyper Micro SIDELED® LS Y876, LA Y876, LO Y876, LY Y876 LT Y87S - SmartLED LW L88C, LW L88S LB L89C, LB L89S, LG L890 LS L89K, LO L89K, LY L89K LS L896, LA L896, LO L896, LY L896 - TOPLED LS T670, LO T670, LY T670, LG T670, LP T670 LSG T670, LSP T670, LSY T670, LOP T670, LYG T670 LG T671, LOG T671, LSG T671 LB T673, LV T673, LT T673, LW T673 LH T674 LS T676, LA T676, LO T676, LY T676, LB T676, LH T676, LSB T676, LW T676 LB T67C, LV T67C, LT T67C, LS T67K, LO T67K, LY T67K, LW E67C LS E67B, LA E67B, LO E67B, LY E67B, LB E67C, LV E67C, LT E67C LW T67C LS T679, LY T679, LG T679 LS T770, LO T770, LY T770, LG T770, LP T770 LB T773, LV T773, LT T773, LW T773 LH T774 LS E675, LA E675, LY E675, LS T675 LS T776, LA T776, LO T776, LY T776, LB T776 LHGB T686 LT T68C, LB T68C - Hyper Mini TOPLED® LB M676 - Mini TOPLED Santana® LG M470 LS M47K, LO M47K, LY M47K Source: http://www.osram.convergy.de LUXEON: - LUMILED® LXK2-PW12-R00, LXK2-PW12-S00, LXK2-PW14-U00, LXK2-PW14-V00 LXK2-PM12-R00, LXK2-PM12-S00, LXK2-PM14-U00 LXK2-PE12-Q00, LXK2-PE12-R00, LXK2-PE12-S00, LXK2-PE14-T00, LXK2-PE14-U00 LXK2-PB12-K00, LXK2-PB12-L00, LXK2-PB12-M00, LXK2-PB14-N00, LXK2-PB14-P00, LXK2-PB14-Q00 LXK2-PR12-L00, LXK2-PR12-M00, LXK2-PR14-Q00, LXK2-PR14-R00 LXK2-PD12-Q00, LXK2-PD12-R00, LXK2-PD12-S00 LXK2-PH12-R00, LXK2-PH12-S00 LXK2-PL12-P00, LXK2-PL12-Q00, LXK2-PL12-R00 Source: www.luxeon.com KINGBRIGHT: KA-3528ASYC Source: www.kingbright.com
Q1-Q3 = crystal-geyer_V1_0:KX: Quartz Crystals (MHz) SMD: KX - Serie Model Size l/w/h [mm] Frequency Range Frequency Stability Temp. Range [°C] Load Capacitance AECQ 200 availabel Datasheet KX-4 KX-5 KX-6 KX-7 KX-9A KX-9B KX-12A KX-12B KX-13 KX-20 KX-K KX-KS 1.6/1.2/0.3 2.0/1.6/0.45 2.5/2.0/0.55 3.2/2.5/0.8 5.0/3.2/1.0 5.0/3.2/1.1 6.0/3.5/1.1 6.0/3.5/1.0 7.0/5.0 /1.3 11.6/5.5/1.6 12.3/4.5/4.2 12.3/4.5/3.2 24.0 ~ 80.0 MHz 16.0 ~ 80.0 MHz 12.0 ~ 80.0 MHz 8.0 ~ 60.0 MHz 7,68 ~ 300,0 MHz 8,0 ~ 50,0 MHz 8,0 ~ 150,0 MHz 8,0 ~ 50,0 MHz 6,0 ~ 160,0 MHz 3,579 ~ 25,0 MHz 3,579 ~ 70,0 MHz 3,579 ~ 70,0 MHz ±10 … ±50ppm ±10 … ±50ppm ±10 … ±50ppm ±10 … ±50ppm ±10 … ±50ppm ±10 … ±50ppm ±10 … ±50ppm ±10 … ±50ppm ±10 … ±50ppm ±50ppm ±10 … ±50ppm ±10 … ±50ppm (*) -40°C …+85°C (*) -40°C …+125°C (*) -40°C …+125°C (*) -40°C …+125°C (*) -40°C …+105°C (*) -40°C …+105°C (*) -40°C …+125°C (*) -40°C …+105°C (*) -40°C …+105°C (*) -40°C …+105°C (*) -40°C …+85°C (*) -40°C …+85°C 8, 8…16 8, 8…16 10, 8…16 12, 7…20 16, 10…20 16, 10…20 16, 10…20 16, 12…20 16, 12…20 16, 12…20 16, 12…30 16, 12…30 - yes yes yes - - - - - - - - KX-4.pdf <http://www.geyer-electronic.de/uploads/tx_userartikelfrequenz/GEYER-KX-4.pdf> KX-5.pdf <http://www.geyer-electronic.de/uploads/tx_userartikelfrequenz/GEYER-KX-5.pdf> KX-6.pdf <http://www.geyer-electronic.de/uploads/tx_userartikelfrequenz/GEYER-KX-6.pdf> KX-7.pdf <http://www.geyer-electronic.de/uploads/tx_userartikelfrequenz/GEYER-KX-7.pdf> KX-9A.pdf <http://www.geyer-electronic.de/uploads/tx_userartikelfrequenz/GEYER-KX-9A.pdf> KX-9B.pdf <http://www.geyer-electronic.de/uploads/tx_userartikelfrequenz/GEYER-KX-9B.pdf> KX-12A.pdf <http://www.geyer-electronic.de/uploads/tx_userartikelfrequenz/GEYER-KX-12A.pdf> KX-12B.pdf <http://www.geyer-electronic.de/uploads/tx_userartikelfrequenz/GEYER-KX-12B.pdf> KX-13.pdf <http://www.geyer-electronic.de/uploads/tx_userartikelfrequenz/GEYER-KX-13.pdf> KX-20.pdf <http://www.geyer-electronic.de/uploads/tx_userartikelfrequenz/GEYER-KX-20.pdf> KX-K.pdf <http://www.geyer-electronic.de/uploads/tx_userartikelfrequenz/GEYER-KX-K.pdf> KX-KS.pdf <http://www.geyer-electronic.de/uploads/tx_userartikelfrequenz/GEYER-KX-KS.pdf> <http://www.geyer-electronic.de/fileadmin/template/img/logo-geyer-electronic.png> Details see: http://www.geyer-electronic.de/Frequenz-Produkte.9.0.html Created 2016-06-07, Hans Locher 2016 (C) Geyer Quartz Technology KX4,KX5,KX6,KX7,KX9A,KX9B,KX12A,KX12B,KX13,KX20,KXK,KXKS;1612;2016;2520;3225;5032;6035;7050;11655;12345;1,6x1,2;2,0x1,6;2,5x2,0;3,2x2,5;5,0x3,2;6,0x3,5;7,0x5,0;11,6x5,5;12,3x4,5;12,3x4,5;1.6x1.2;2.0x1.6;2.5x2.0;3.2x2.5;5.0x3.2;6.0x3.5;7.0x5.0;11.6x5.5;12.3x4.5;12.3x4.5;
R1-R48 = rcl:R-EU_: RESISTOR, European symbol; SPICEPREFIX: R
RN1-RN8 = resistor-dil:4R-N: Array Chip Resistor Source: RS Component / Phycomp; OC_FARNELL: unknown; OC_NEWARK: unknown
S1 = smd-special:SWS004: SMD Dip Switch 4 pol.
T1 = led:LED: LED OSRAM: - CHIPLED LG R971, LG N971, LY N971, LG Q971, LY Q971, LO R971, LY R971 LH N974, LH R974 LS Q976, LO Q976, LY Q976 LO Q996 - Hyper CHIPLED LW Q18S LB Q993, LB Q99A, LB R99A - SideLED LS A670, LO A670, LY A670, LG A670, LP A670 LB A673, LV A673, LT A673, LW A673 LH A674 LY A675 LS A676, LA A676, LO A676, LY A676, LW A676 LS A679, LY A679, LG A679 - Hyper Micro SIDELED® LS Y876, LA Y876, LO Y876, LY Y876 LT Y87S - SmartLED LW L88C, LW L88S LB L89C, LB L89S, LG L890 LS L89K, LO L89K, LY L89K LS L896, LA L896, LO L896, LY L896 - TOPLED LS T670, LO T670, LY T670, LG T670, LP T670 LSG T670, LSP T670, LSY T670, LOP T670, LYG T670 LG T671, LOG T671, LSG T671 LB T673, LV T673, LT T673, LW T673 LH T674 LS T676, LA T676, LO T676, LY T676, LB T676, LH T676, LSB T676, LW T676 LB T67C, LV T67C, LT T67C, LS T67K, LO T67K, LY T67K, LW E67C LS E67B, LA E67B, LO E67B, LY E67B, LB E67C, LV E67C, LT E67C LW T67C LS T679, LY T679, LG T679 LS T770, LO T770, LY T770, LG T770, LP T770 LB T773, LV T773, LT T773, LW T773 LH T774 LS E675, LA E675, LY E675, LS T675 LS T776, LA T776, LO T776, LY T776, LB T776 LHGB T686 LT T68C, LB T68C - Hyper Mini TOPLED® LB M676 - Mini TOPLED Santana® LG M470 LS M47K, LO M47K, LY M47K Source: http://www.osram.convergy.de LUXEON: - LUMILED® LXK2-PW12-R00, LXK2-PW12-S00, LXK2-PW14-U00, LXK2-PW14-V00 LXK2-PM12-R00, LXK2-PM12-S00, LXK2-PM14-U00 LXK2-PE12-Q00, LXK2-PE12-R00, LXK2-PE12-S00, LXK2-PE14-T00, LXK2-PE14-U00 LXK2-PB12-K00, LXK2-PB12-L00, LXK2-PB12-M00, LXK2-PB14-N00, LXK2-PB14-P00, LXK2-PB14-Q00 LXK2-PR12-L00, LXK2-PR12-M00, LXK2-PR14-Q00, LXK2-PR14-R00 LXK2-PD12-Q00, LXK2-PD12-R00, LXK2-PD12-S00 LXK2-PH12-R00, LXK2-PH12-S00 LXK2-PL12-P00, LXK2-PL12-Q00, LXK2-PL12-R00 Source: www.luxeon.com KINGBRIGHT: KA-3528ASYC Source: www.kingbright.com; JLCPCB-PART: C84256
TERM = jumper:JP1E: JUMPER
U$15 = MaeCAN_logo:BUTTON_JLC
X1-X4 = con-weidmueller-sl35:180-10: WEIDMUELLER CLAMP CONNECTOR; OC_FARNELL: unknown; OC_NEWARK: unknown
X5 X7 = con-weidmueller-sl35:180-2: WEIDMUELLER CLAMP CONNECTOR; OC_FARNELL: unknown; OC_NEWARK: unknown
X6 = con-cypressindustries:MINI-USB_SHIELD5P2-: MINI USB-B R/A DIP 5pol. Source: www.cypressindustries.com; OC_FARNELL: unknown; OC_NEWARK: unknown
X17 = con-weidmueller-sl35:180-3: WEIDMUELLER CLAMP CONNECTOR; OC_FARNELL: unknown; OC_NEWARK: unknown